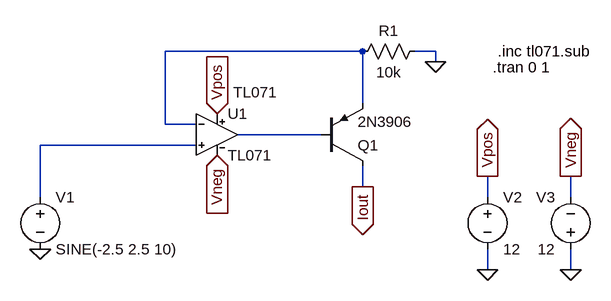
[diagram p0: schematic v2i-b.asc]
v2i-b.asc, the LTspice schematic file:
Version 4
SHEET 1 1184 680
WIRE 512 160 208 160
WIRE 624 160 592 160
WIRE 624 176 624 160
WIRE 512 240 512 160
WIRE 208 272 208 160
WIRE 256 272 208 272
WIRE 448 288 320 288
WIRE 256 304 16 304
WIRE 512 368 512 336
WIRE 16 384 16 304
WIRE 704 384 704 352
WIRE 832 384 832 352
WIRE 704 496 704 464
WIRE 832 496 832 464
FLAG 704 496 0
FLAG 832 496 0
FLAG 704 352 Vpos
IOPIN 704 352 Out
FLAG 832 352 Vneg
IOPIN 832 352 Out
FLAG 288 256 Vpos
IOPIN 288 256 In
FLAG 288 320 Vneg
IOPIN 288 320 In
FLAG 16 464 0
FLAG 624 176 0
FLAG 512 368 Iout
IOPIN 512 368 Out
SYMBOL pnp 448 336 M180
SYMATTR InstName Q1
SYMATTR Value 2N3906
SYMBOL voltage 704 368 R0
SYMATTR InstName V2
SYMATTR Value 12
SYMBOL voltage 832 480 R180
WINDOW 0 24 96 Left 2
WINDOW 3 24 16 Left 2
SYMATTR InstName V3
SYMATTR Value 12
SYMBOL Voltage 16 368 R0
SYMATTR InstName V1
SYMATTR Value SINE(-2.5 2.5 10)
SYMBOL TL071 288 224 R0
WINDOW 38 25 -1 Left 2
SYMATTR InstName U1
SYMBOL res 608 144 R90
WINDOW 0 0 56 VBottom 2
WINDOW 3 32 56 VTop 2
SYMATTR InstName R1
SYMATTR Value 10k
TEXT 712 184 Left 2 !.tran 0 1
TEXT 720 160 Left 2 !.inc tl071.sub

The netlist it stands for:
* v2i-b.asc
Q1 Iout N002 N001 0 2N3906
V2 Vpos 0 12
V3 0 Vneg 12
V1 N003 0 SINE(-2.5 2.5 10)
XU1 N003 N001 Vpos Vneg N002 TL071 TL071  ; pins In+ In- V+ V- OUT
R1 0 N001 10k
.model NPN NPN
.model PNP PNP
.lib standard.bjt
.tran 0 1
.inc tl071.sub
.lib TL071.sub
.backanno
.end